# Altium schematic sheet Leptons.SchDoc
size A; SheetNumber: 1; SheetTotal: 1
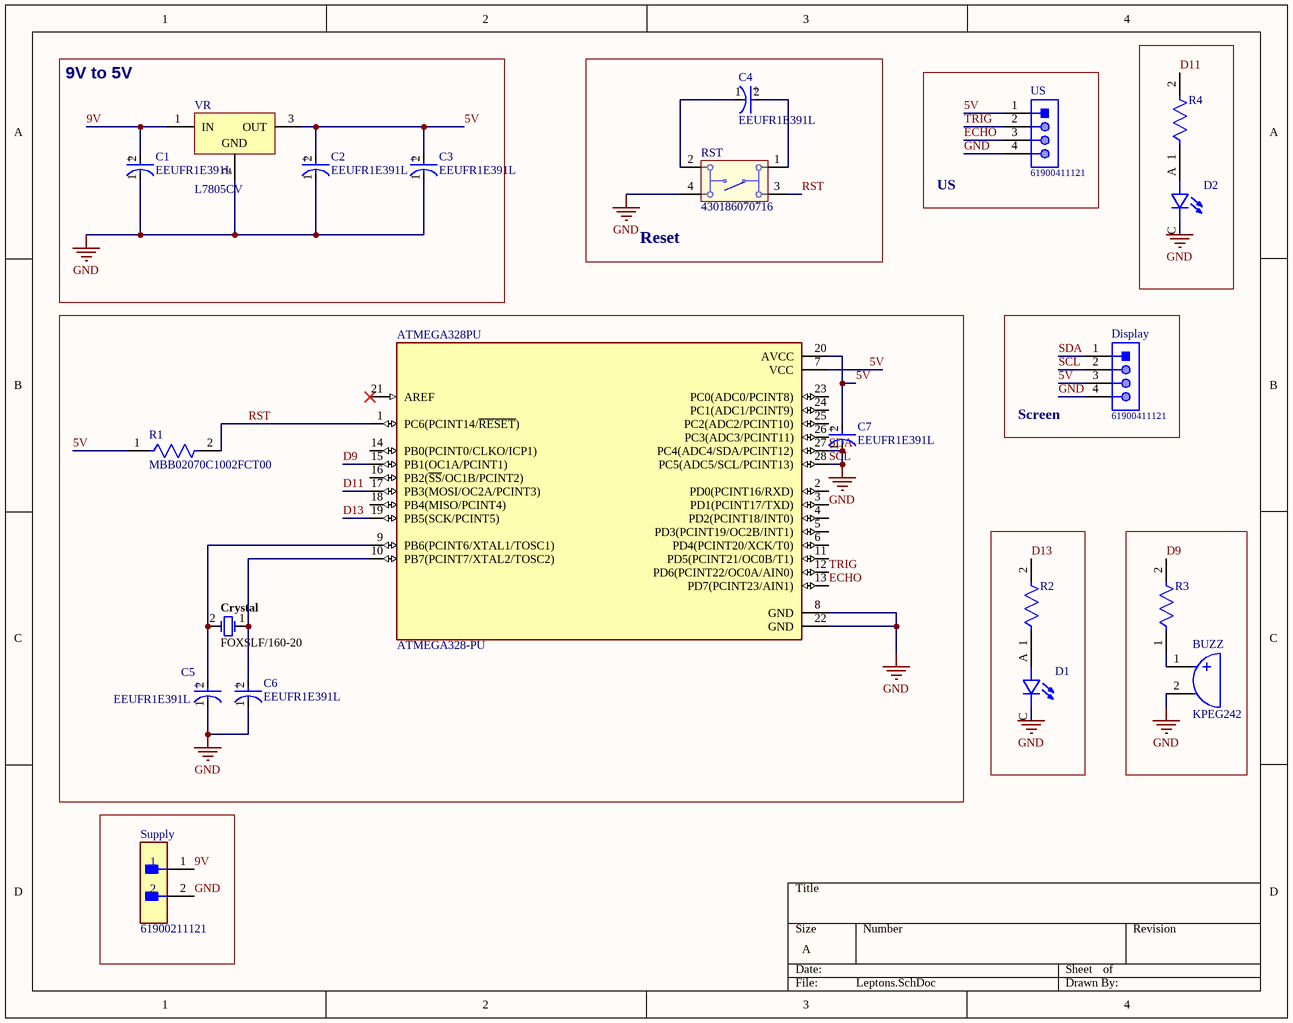
[diagram p0: Leptons.SchDoc]

## Parts
ATMEGA328PU  ATMEGA328-PU  [DIP787W46P254L3467H508Q28]
BUZZ  KPEG242  [KINGS-KPEG242-2]
C1  EEUFR1E391L  [FP-RAD-TH-D_8_0_5-L_15_1-MFG]
C2  EEUFR1E391L  [FP-RAD-TH-D_8_0_5-L_15_1-MFG]
C3  EEUFR1E391L  [FP-RAD-TH-D_8_0_5-L_15_1-MFG]
C4  EEUFR1E391L  [FP-RAD-TH-D_8_0_5-L_15_1-MFG]
C5  EEUFR1E391L  [FP-RAD-TH-D_8_0_5-L_15_1-MFG]
C6  EEUFR1E391L  [FP-RAD-TH-D_8_0_5-L_15_1-MFG]
C7  EEUFR1E391L  [FP-RAD-TH-D_8_0_5-L_15_1-MFG]
Crystal  FOXSLF/160-20  [FOX-FOXSLF160-20]
D1  L08R5000Q1  [LEDRD254W57D500H1070]  (value not drawn)
D2  L08R5000Q1  [LEDRD254W57D500H1070]  (value not drawn)
Display  61900411121  [61900411121]
R1  MBB02070C1002FCT00  [FP-MBB0207-MFG]
R2  MBB02070C1002FCT00  [FP-MBB0207-MFG]  (value not drawn)
R3  MBB02070C1002FCT00  [FP-MBB0207-MFG]  (value not drawn)
R4  MBB02070C1002FCT00  [FP-MBB0207-MFG]  (value not drawn)
RST  430186070716  [430186070716]
Supply  61900211121  [FP-61900211121-MFG]
US  61900411121  [61900411121]
VR  L7805CV  [TO220]

## Blocks framed on the sheet
9V to 5V: C1-C3 VR
Reset: C4 RST
US: US
Screen: Display

## Nets
GND: ATMEGA328PU.8(GND) ATMEGA328PU.22(GND) ATMEGA328PU.27(PC4(ADC4/SDA/PCINT12)) ATMEGA328PU.28(PC5(ADC5/SCL/PCINT13)) BUZZ.2 C1.1(C) C2.1(C) C3.1(C) C5.1(C) C6.1(C) C7.1(C) D1.C D2.C Display.1 Display.2 Display.4 RST.4 Supply.2 US.4 VR.2(GND)  [also labelled SCL, SDA]
5V: ATMEGA328PU.7(VCC) ATMEGA328PU.20(AVCC) C2.2(A) C3.2(A) C7.2(A) Display.3 R1.1 US.1 VR.3(OUT)
9V: C1.2(A) Supply.1 VR.1(IN)
D9: ATMEGA328PU.15(PB1(OC1A/PCINT1)) R3.2
D11: ATMEGA328PU.17(PB3(MOSI/OC2A/PCINT3)) R4.2
D13: ATMEGA328PU.19(PB5(SCK/PCINT5)) R2.2
ECHO: ATMEGA328PU.13(PD7(PCINT23/AIN1)) US.3
RST: ATMEGA328PU.1(PC6(PCINT14/~{RESET})) R1.2 RST.3
TRIG: ATMEGA328PU.12(PD6(PCINT22/OC0A/AIN0)) US.2
NetATMEGA328PU_9: ATMEGA328PU.9(PB6(PCINT6/XTAL1/TOSC1)) C5.2(A) Crystal.2
NetATMEGA328PU_10: ATMEGA328PU.10(PB7(PCINT7/XTAL2/TOSC2)) C6.2(A) Crystal.1
NetBUZZ_1: BUZZ.1 R3.1
NetC4_1: C4.1(C) RST.2
NetC4_2: C4.2(A) RST.1
NetD1_A: D1.A R2.1
NetD2_A: D2.A R4.1

Not connected (* = marked no-connect by the designer): ATMEGA328PU 2(PD0(PCINT16/RXD)) 3(PD1(PCINT17/TXD)) 4(PD2(PCINT18/INT0)) 5(PD3(PCINT19/OC2B/INT1)) 6(PD4(PCINT20/XCK/T0)) 11(PD5(PCINT21/OC0B/T1)) 14(PB0(PCINT0/CLKO/ICP1)) 16(PB2(~{SS}/OC1B/PCINT2)) 18(PB4(MISO/PCINT4)) 21(AREF)* 23(PC0(ADC0/PCINT8)) 24(PC1(ADC1/PCINT9)) 25(PC2(ADC2/PCINT10)) 26(PC3(ADC3/PCINT11))

## Notes on the sheet
- (in symbol CMP-05427-000460-1) +

## Library data of the parts
ATMEGA328PU = ATMEGA328-PU: AVR AVRÂ® ATmega Microcontroller IC 8-Bit 20MHz 32KB (16K x 16) FLASH 28-PDIP; MF: Microchip; Availability: In Stock; MP: ATMEGA328-PU; SnapEDA_Link: https://www.snapeda.com/parts/ATMEGA328-PU/Microchip/view-part/?ref=snap; Value: *; Price: None; Purchase-URL: https://pricing.snapeda.com/search/part/ATMEGA328-PU/?ref=eda; Check_prices: https://www.snapeda.com/parts/ATMEGA328-PU/Microchip/view-part/?ref=eda; Package: DIP-28 Microchip Technology
BUZZ = CMP-2000-06518-1: Piezo Indicator, 4100 Hz, 3 to 16 V, -20 to 70 degC, 2-Pin THD, RoHS; PartNumber: KPE-242; Manufacturer: KingstateElectronicsCorp.; Frequency Range: 3600to4600Hz; Maximum Supply Current: 7mA; Typical Operating Supply Voltage: 12Vdc; Product Height: 7.6mm; Current - Max: 7A; Tone Mode: Continuous; Product Diameter: 13.7mm; Minimum Sound Pressure: 70dBA; Maximum Resonant Frequency: 4600Hz; Type: Indicator; Datasheet URL: https://datasheet.ciiva.com/11776/0900766b8068f3a2-11776713.pdf; Mounting: ThroughHole; Technology: Piezo; Operating Temperature: -20to70°C; Category: AudioIndicatorsandAlerts; Termination Method: Pin; Manufacturer URL: http://www.kingstate.com.tw/index.php/en/; Package Description: 2-Pin Through Hole Device, Body Dia 13.7 mm, Pitch 7.62 mm; Datasheet Version: 01/2006; Package Reference: KPEG242; Mounting Technology: ThroughHole
C1-C7 = CMP-05427-000460-1: Aluminum Electrolytic Capacitors (Radial Lead Type) 390uF ±20% 25V; Impedance: 41mR; Lead Diameter: 0.6mm; Ripple Current (AC): 1.24A; Life (Hours): 8000Hour; Dielectric Material: Aluminium; Length: 15mm; Case/Package: Radial; Termination: Radial; Tolerance: 20%; Series: FR; RoHS Compliant: Yes; Height: 15mm; Package Quantity: 200; Construction: RADIAL; Diameter: 8mm; Mount: Through Hole; REACH SVHC: No SVHC; Voltage Rating: 25V; Packaging: Bulk; ESR (Equivalent Series Resistance): 41mR; Min Operating Temperature: -40°C; Ripple Current: 1.24A; Max Operating Temperature: 105°C; Lead Pitch: 3.5mm; Radiation Hardening: No; Capacitance: 390uF; Voltage: 25V; Number of Pins: 2; Height - Seated (Max): 0.65inch; Voltage Rating (DC): 25V
Crystal = CMP-1749-00003-1: Resistance Weld Thru-Hole Crystal, 16 MHz, -20 to 70 degC, 2-Pin THD, RoHS, Bulk; Voltage Rating: 250 V; Tolerance: 1%; Resistance: 221 kohm; Case\Package: Axial; Power Rating: 250 mW; RoHSCompliant: true; Package Quantity: 200; Packaging: Bulk; Min Operating Temperature: -55 degC; DatasheetVersion: Mar-15; ComponentLink1URL: http://www.foxonline.com/; Max Operating Temperature: 155 degC; PackageReference: FOXSLF160-20; Mount: Through Hole; PackageDescription: 2-Pin Through Hole Device, Body 11.35 x 4.65 mm; ComponentLink1Description: Manufacturer URL; ComponentLink2URL: http://www.foxonline.com/pdfs/hc49slf.pdf; ComponentLink2Description: Datasheet; Length: 0.248 inch
D1 D2 = L08R5000Q1: LED, 5MM, ORANGE; LED / Lamp Size: 5mm / T-1 3/4; LED Colour: Orange; Typ Luminous Intensity: 4.3mcd; Viewing Angle: ...; MF: LED Technology; Value: *; SnapEDA_Link: https://www.snapeda.com/parts/L08R5000Q1/LED+Technology/view-part/?ref=snap; MP: L08R5000Q1; Check_prices: https://www.snapeda.com/parts/L08R5000Q1/LED+Technology/view-part/?ref=eda; Availability: In Stock; Price: None; Package: None
Display US = CMP-1502-00586-1: Male Locking Header WR-WTB, THT, Vertical, pitch 2.54 mm, 1 x 4 position; Manufacturer: Wurth Elektronik; Working Voltage: 250VAC; Pitch: 2.54mm; Contact Resistance: 20mOhm; Position: 1x4; Publisher: WurthElektronik; Manufacturer URL: http://www.we-online.de; Datasheet URL: https://katalog.we-online.de/em/datasheet/6190xx11121.pdf; Operating Temperature: -40to105degC; Packaging: Bag; Gender: Male; Package Reference: 61900411121; Orientation: Vertical; Mounting Technology: THT; Part Number: 61900411121
R1-R4 = CMP-02408-000035-1: RES 10K OHM 0.6W 1% AXIAL; Voltage Rating: 300V; Resistance: 10kR; Max Power Dissipation: 600mW; Temperature Coefficient: 50ppm/°C; Radiation Hardening: No; Case/Package: Conformal; Termination: Axial; Military Standard: Not; Length: 6.5mm; Voltage Rating (DC): 300V; RoHS Compliant: Yes; Number of Terminations: 2; Packaging: Tape and Reel; Features: Automotive AEC-Q200; Tolerance: 1%; Min Operating Temperature: -55°C; Power Rating: 600mW; Lead Free: Lead Free; Resistor Type: Metal Film; Construction: Cylindrical; Series: MBB 0207 - Professional; Max Operating Temperature: 155°C; Diameter: 2.5mm; Resistance Tolerance: 1%; Contact Plating: Tin; Technology: THIN FILM
RST = CMP-1453-00013-1: WS-TATV THT Tact Switch 6X6 mm; Manufacturer: Wuerth Elektronik; NoPins: 04; PackageReference: 430186070716; ComponentLink2Description: Datasheet; ComponentLink1Description: Manufacturer URL; PartNumber: 430186070716; ComponentLink2URL: http://katalog.we-online.de/em/datasheet/4301x6.pdf; ComponentLink1URL: http://www.we-online.com
Supply = CMP-1502-00584-2: CONN HEADER VERT 2POS 2.54MM; Number of Contacts: 2; Gender: Male; Current Rating: 3A; Voltage Rating: 250V; Insulation Resistance: 1GR; Contact Material: Copper Alloy; Package Quantity: 1000; Color: Beige; Mount: Through Hole; Termination: Through Hole; Fastening Type: Friction; Contact Mating Length: 0.295inch; Pitch: 2.54mm; Max Operating Temperature: 105°C; Height: 14.2mm; RoHS Compliant: Yes; Packaging: Bulk; Contact Type: Male Pin; Width: 5.12mm; Housing Material: Nylon; Min Operating Temperature: -40°C; Insulation Material: Nylon; Contact Finish - Mating: TIN; Insulation Color: Beige; Contact Plating: Tin; Flammability Rating: UL94 V-0; Length: 5.8mm; Contact Gender: Male; Connector Type: Header; Contact Shape: Square; Series: WR-WTB; Number of Positions: 2; Number of Rows: 1
VR = CMP-0244-00483-1: Positive Voltage Regulator, 5V, 3-Pin TO-220; PackageDescription: TO, Thru-Hole, Vertical, Heatsink Mounted; 3 In-Line Leads; Pitch 2.54 mm; ComponentLink2Description: Datasheet; PackageReference: TO220; ComponentLink3URL: http://www.st.com/internet/com/TECHNICAL_RESOURCES/TECHNICAL_LITERATURE/PACKAGE_INFORMATION/CD00004649.pdf; DatasheetVersion: 16/11/2011; ComponentLink1Description: Manufacturer URL; ComponentLink1URL: http://www.st.com; PackageVersion: ver3.0; ComponentLink3Description: Package Specification; ComponentLink2URL: http://www.st.com/internet/com/TECHNICAL_RESOURCES/TECHNICAL_LITERATURE/DATASHEET/CD00000444.pdf